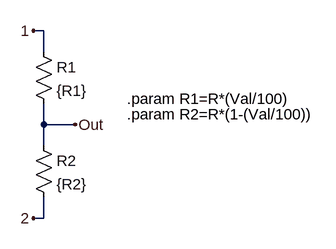
[diagram p0: schematic Potentiometer.asc]
Potentiometer.asc, the LTspice schematic file:
Version 4
SHEET 1 880 680
WIRE 144 16 128 16
WIRE 144 48 144 16
WIRE 144 160 144 128
WIRE 192 160 144 160
WIRE 144 192 144 160
WIRE 144 304 144 272
WIRE 144 304 128 304
FLAG 128 16 1
FLAG 128 304 2
FLAG 192 160 Out
SYMBOL res 128 32 R0
SYMATTR InstName R1
SYMATTR Value {R1}
SYMBOL res 128 176 R0
SYMATTR InstName R2
SYMATTR Value {R2}
TEXT 272 120 Left 2 !.param R1=R*(Val/100)
TEXT 272 144 Left 2 !.param R2=R*(1-(Val/100))

The netlist it stands for:
* Potentiometer.asc
R1 1 Out {R1}
R2 Out 2 {R2}
.param R1=R*(Val/100)
.param R2=R*(1-(Val/100))
.backanno
.end